# Altium schematic sheet Gator Stream Transmitter Sheet.SchDoc
size Letter
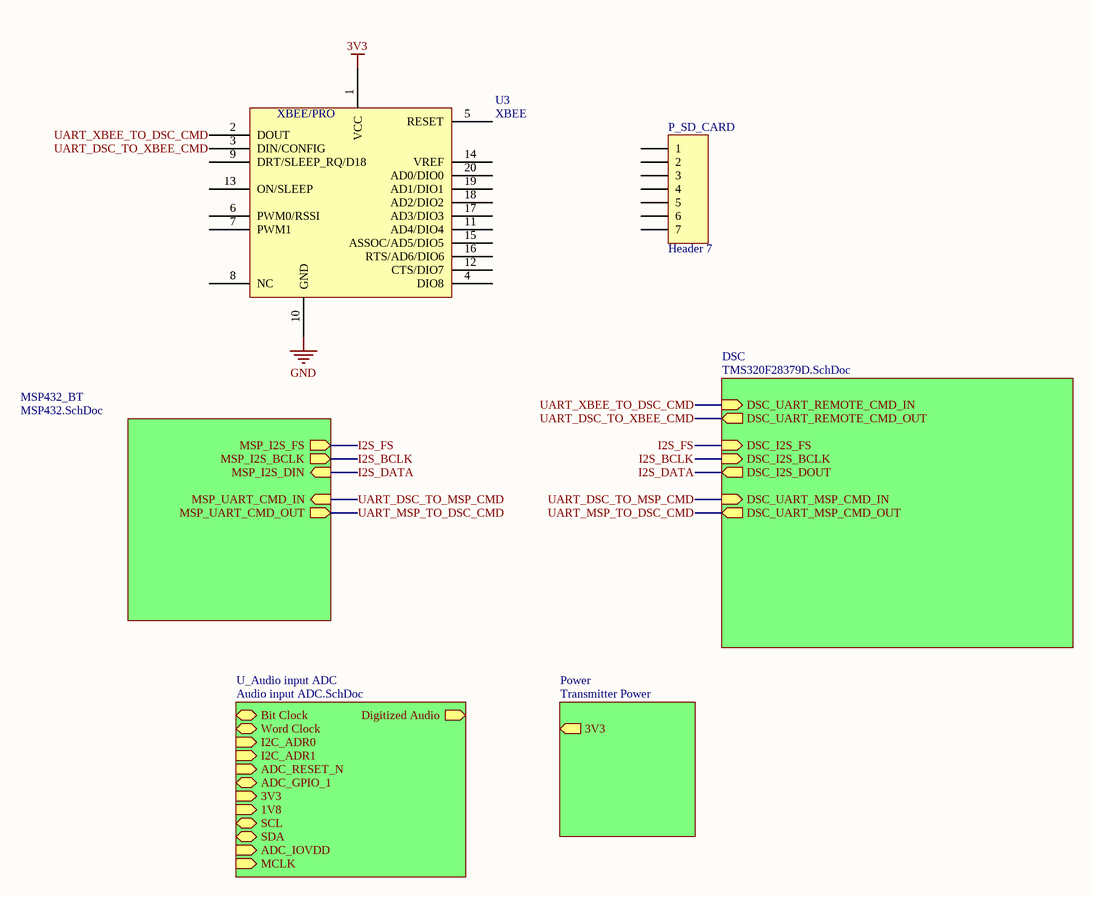
[diagram p0: Gator Stream Transmitter Sheet.SchDoc]

## Parts
P_SD_CARD  Header 7  [HDR1X7]
U3  XBEE  [XBEE/PRO]

## Sub-sheets
DSC = TMS320F28379D.SchDoc: DSC_I2S_FS (in), DSC_UART_MSP_CMD_IN (in), DSC_UART_MSP_CMD_OUT (out), DSC_I2S_DOUT (out), DSC_I2S_BCLK (in), DSC_UART_REMOTE_CMD_IN (in), DSC_UART_REMOTE_CMD_OUT (out)
MSP432_BT = MSP432.SchDoc: MSP_I2S_FS (out), MSP_I2S_DIN (in), MSP_UART_CMD_OUT (out), MSP_UART_CMD_IN (in), MSP_I2S_BCLK (out)
Power = Transmitter Power: 3V3 (out)
U_Audio input ADC = Audio input ADC.SchDoc: Digitized Audio (out), Bit Clock (bidir), Word Clock (bidir), I2C_ADR0 (in), I2C_ADR1 (in), ADC_RESET_N (in), ADC_GPIO_1 (bidir), 3V3 (in), 1V8 (in), SCL (bidir), SDA (bidir), ADC_IOVDD (in), MCLK (in)

## Nets
3V3: U3.1(VCC)
GND: U3.10(GND)
I2S_BCLK: sheet MSP432_BT/MSP_I2S_BCLK, sheet DSC/DSC_I2S_BCLK
I2S_DATA: sheet MSP432_BT/MSP_I2S_DIN, sheet DSC/DSC_I2S_DOUT
I2S_FS: sheet MSP432_BT/MSP_I2S_FS, sheet DSC/DSC_I2S_FS
UART_DSC_TO_MSP_CMD: sheet MSP432_BT/MSP_UART_CMD_IN, sheet DSC/DSC_UART_MSP_CMD_IN
UART_DSC_TO_XBEE_CMD: U3.3(DIN/CONFIG) ; sheet DSC/DSC_UART_REMOTE_CMD_OUT
UART_MSP_TO_DSC_CMD: sheet MSP432_BT/MSP_UART_CMD_OUT, sheet DSC/DSC_UART_MSP_CMD_OUT
UART_XBEE_TO_DSC_CMD: U3.2(DOUT) ; sheet DSC/DSC_UART_REMOTE_CMD_IN

Not connected (* = marked no-connect by the designer): P_SD_CARD 1 2 3 4 5 6 7; U3 4(DIO8) 5(RESET) 6(PWM0/RSSI) 7(PWM1) 8(NC) 9(DRT/SLEEP_RQ/D18) 11(AD4/DIO4) 12(CTS/DIO7) 13(ON/SLEEP) 14(VREF) 15(ASSOC/AD5/DIO5) 16(RTS/AD6/DIO6) 17(AD3/DIO3) 18(AD2/DIO2) 19(AD1/DIO1) 20(AD0/DIO0)

## Notes on the sheet
- (in symbol XBEE) XBEE/PRO

## Library data of the parts
P_SD_CARD = Header 7: Header, 7-Pin; LatestRevisionDate: 17-Jul-2002; LatestRevisionNote: Re-released for DXP Platform.; Publisher: Altium Limited